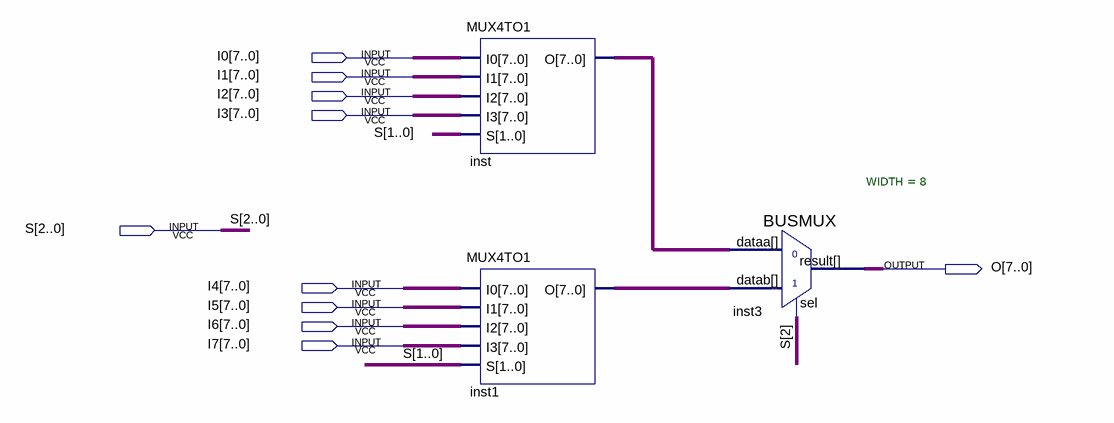
[diagram p0: schematic sheet]
// Quartus schematic MUX8TO1.bdf as structural Verilog: 3 symbols, 10 pins
module MUX8TO1 (
  input  [7:0] I0,
  input  [7:0] I1,
  input  [7:0] I2,
  input  [7:0] I3,
  input  [2:0] S,
  input  [7:0] I4,
  input  [7:0] I5,
  input  [7:0] I6,
  input  [7:0] I7,
  output [7:0] O
);

  wire [7:0] inst1_o, inst_o;

  MUX4TO1 inst (.I0(I0), .I1(I1), .I2(I2), .I3(I3), .S(S[1:0]), .O(inst_o));
  MUX4TO1 inst1 (.I0(I4), .I1(I5), .I2(I6), .I3(I7), .S(S[1:0]), .O(inst1_o));
  BUSMUX #(.WIDTH(8)) inst3 (.datab(inst1_o), .sel(S[2]), .dataa(inst_o), .result(O));
endmodule
